# Altium schematic sheet Motor control.SchDoc
size A; SheetNumber: 6; SheetTotal: 6
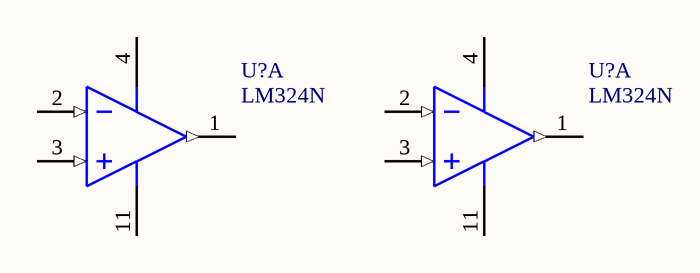
[diagram p0: Motor control.SchDoc]

## Parts
(Parts that share a designator on the sheet are numbered #1, #2 ... from top to bottom, then left to right.)
U?#1  LM324N  [N0014A]  (part A of 4)
U?#2  LM324N  [N0014A]  (part A of 4)

## Nets

Not connected (* = marked no-connect by the designer): U?#1 1(OUT1) 2(IN1-) 3(IN1+) 4(V+) 11(GND); U?#2 1(OUT1) 2(IN1-) 3(IN1+) 4(V+) 11(GND)

## Library data of the parts
U?#1 U?#2 = LM324N: Low Power Quad Operational Amplifier, 14-pin MDIP; Manufacturer: Texas Instruments; CompType: Amplifiers; PowerWise: N; PackageTopMarking: NSUZXYYTTE#*LM324N; PackageDescription: MDIP, .750 x .250 x.130in, 14 Lead, .100in Pitch; Package Reference: N0014A; RoHS: N; Code_JEDEC: MS-001-AA; ComponentLink1URL: http://www.ti.com/general/docs/lit/getliterature.tsp?genericPartNumber=LM324&fileType=pdf; ComponentLink1Description: Datasheet URL; PinCount: 14